# Altium schematic sheet General_design.SchDoc
size A3; Author: Sławomir Małkowski; Organization: Altium Limited; Address1: L3, 12a Rodborough Rd; Address2: Frenchs Forest; Address3: NSW; Address4: Australia 2086; DocumentNumber: 1; SheetNumber: 1; SheetTotal: 19
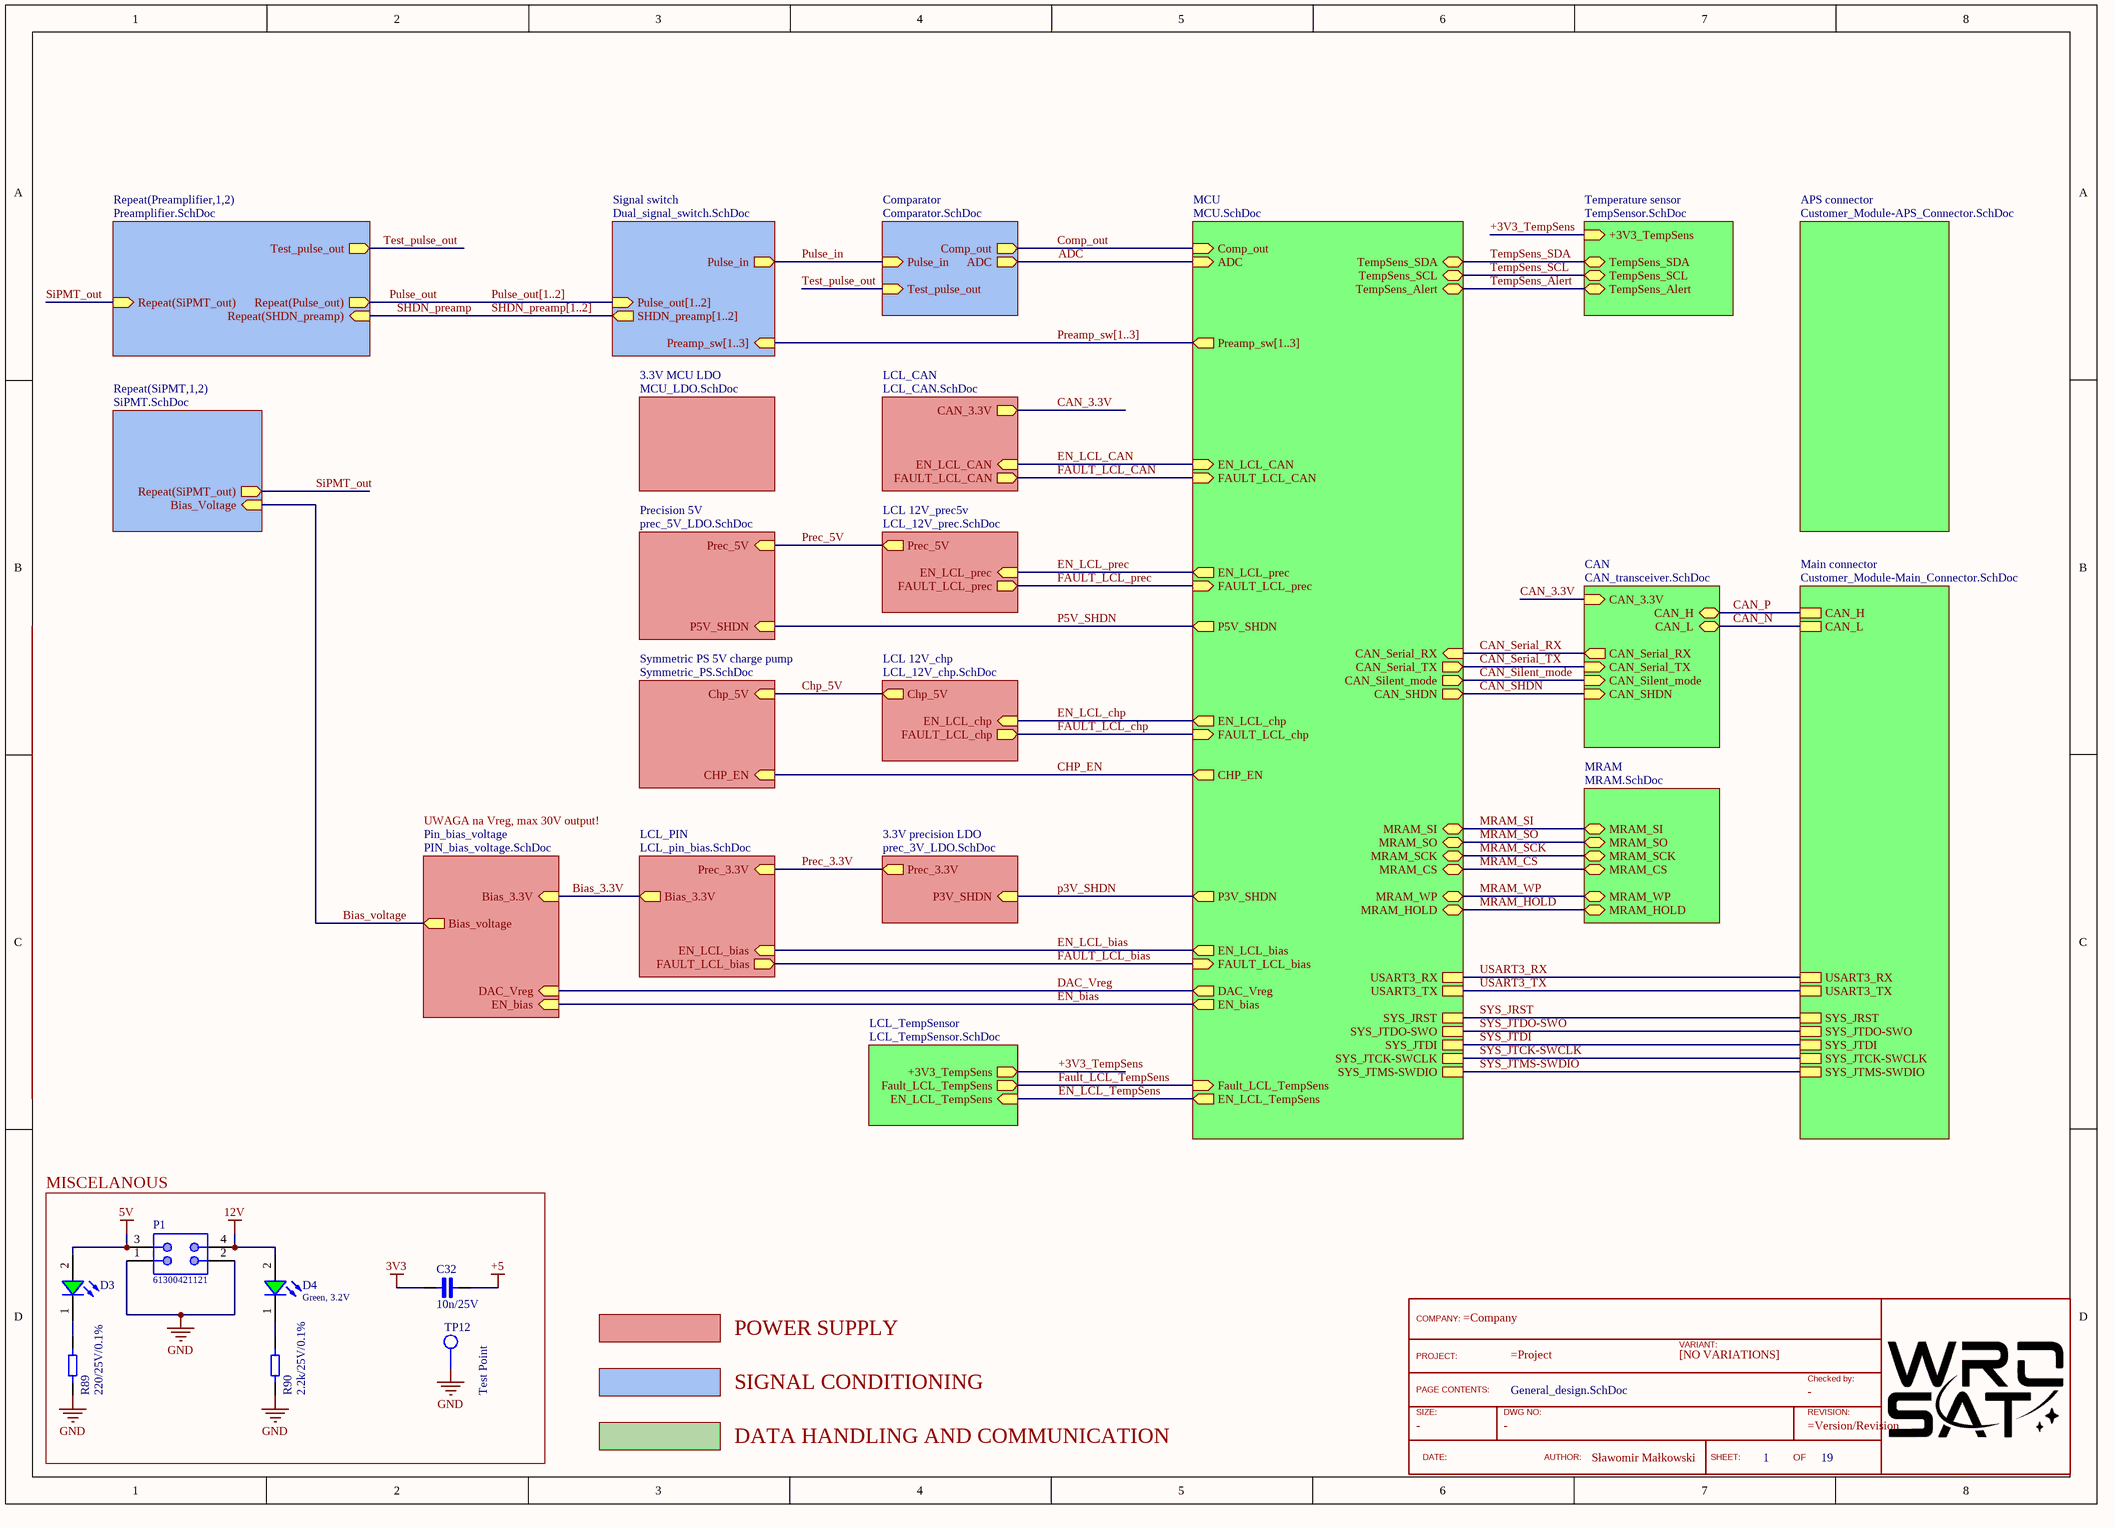
[diagram p0: General_design.SchDoc]

## Parts
?  TitleBlock  (value not drawn)  (graphical)
C32  10n/25V  [Cap_0402]
D3  Green, 3.2V  [WL-SMCW_0603_H=0.7mm]  (value not drawn)
D4  Green, 3.2V  [WL-SMCW_0603_H=0.7mm]
P1  61300421121  [61300421121]
R89  220/25V/0.1%  [RES_0402]
R90  2.2k/25V/0.1%  [RES_0402]
TP12  Test Point  [Test Point SMT]

## Blocks framed on the sheet
MISCELANOUS: C32 D3 D4 P1 R89 R90 TP12

## Sub-sheets
3.3V MCU LDO = MCU_LDO.SchDoc: no entries
3.3V precision LDO = prec_3V_LDO.SchDoc: Prec_3.3V (out), P3V_SHDN (in)
APS connector = Customer_Module-APS_Connector.SchDoc: no entries
CAN = CAN_transceiver.SchDoc: CAN_3.3V (in), CAN_Serial_RX (out), CAN_Serial_TX (in), CAN_H (bidir), CAN_L (bidir), CAN_Silent_mode (in), CAN_SHDN (in)
Comparator = Comparator.SchDoc: Pulse_in (in), Comp_out (out), Test_pulse_out (in), ADC (out)
LCL 12V_chp = LCL_12V_chp.SchDoc: Chp_5V (out), EN_LCL_chp (in), FAULT_LCL_chp (out)
LCL 12V_prec5v = LCL_12V_prec.SchDoc: Prec_5V (out), EN_LCL_prec (in), FAULT_LCL_prec (out)
LCL_CAN = LCL_CAN.SchDoc: EN_LCL_CAN (in), FAULT_LCL_CAN (out), CAN_3.3V (out)
LCL_PIN = LCL_pin_bias.SchDoc: EN_LCL_bias (in), FAULT_LCL_bias (out), Prec_3.3V (in), Bias_3.3V (out)
LCL_TempSensor = LCL_TempSensor.SchDoc: +3V3_TempSens (out), Fault_LCL_TempSens (out), EN_LCL_TempSens (in)
Main connector = Customer_Module-Main_Connector.SchDoc: SYS_JTCK-SWCLK, SYS_JTMS-SWDIO, CAN_H, USART3_RX, CAN_L, SYS_JRST, USART3_TX, SYS_JTDO-SWO, SYS_JTDI
MCU = MCU.SchDoc: Preamp_sw[1..3] (out), Comp_out (in), P3V_SHDN (out), P5V_SHDN (out), CHP_EN (out), EN_LCL_bias (out), FAULT_LCL_bias (in), EN_LCL_prec (out), FAULT_LCL_prec (in), EN_LCL_chp (out), FAULT_LCL_chp (in), EN_bias (out), CAN_Serial_RX (in), CAN_Serial_TX (out), CAN_Silent_mode (out), MRAM_SO (bidir), MRAM_SCK (bidir), MRAM_WP (bidir), MRAM_HOLD (bidir), MRAM_CS (bidir), MRAM_SI (bidir), DAC_Vreg (out), CAN_SHDN (out), SYS_JRST, SYS_JTDO-SWO, SYS_JTDI, SYS_JTCK-SWCLK, SYS_JTMS-SWDIO, USART3_RX, USART3_TX, EN_LCL_CAN (in), FAULT_LCL_CAN (in), TempSens_SDA (bidir), TempSens_SCL (bidir), TempSens_Alert (bidir), Fault_LCL_TempSens (in), EN_LCL_TempSens (out), ADC (in)
MRAM = MRAM.SchDoc: MRAM_SO (bidir), MRAM_SCK (bidir), MRAM_WP (bidir), MRAM_HOLD (bidir), MRAM_CS (bidir), MRAM_SI (bidir)
Pin_bias_voltage = PIN_bias_voltage.SchDoc: Bias_voltage (out), Bias_3.3V (in), EN_bias (in), DAC_Vreg (in)
Precision 5V = prec_5V_LDO.SchDoc: Prec_5V (in), P5V_SHDN (in)
Repeat(Preamplifier,1,2) = Preamplifier.SchDoc: Repeat(SiPMT_out) (in), Repeat(Pulse_out) (out), Repeat(SHDN_preamp) (in), Test_pulse_out (out)
Repeat(SiPMT,1,2) = SiPMT.SchDoc: Bias_Voltage (in), Repeat(SiPMT_out) (out)
Signal switch = Dual_signal_switch.SchDoc: Pulse_out[1..2] (in), Pulse_in (out), Preamp_sw[1..3] (in), SHDN_preamp[1..2] (out)
Symmetric PS 5V charge pump = Symmetric_PS.SchDoc: Chp_5V (in), CHP_EN (in)
Temperature sensor = TempSensor.SchDoc: TempSens_SDA (bidir), TempSens_SCL (bidir), TempSens_Alert (bidir), +3V3_TempSens (in)

## Nets
3V3: C32.1
5V: D3.2(A) P1.3
12V: D4.2(A) P1.4
+5: C32.2
GND: P1.1 P1.2 R89.1 R90.1 TP12.1
+3V3_TempSens: sheet Temperature sensor/+3V3_TempSens, sheet LCL_TempSensor/+3V3_TempSens
ADC: sheet MCU/ADC, sheet Comparator/ADC
Bias_3.3V: sheet Pin_bias_voltage/Bias_3.3V, sheet LCL_PIN/Bias_3.3V
Bias_voltage: sheet Repeat(SiPMT,1,2)/Bias_Voltage, sheet Pin_bias_voltage/Bias_voltage
CAN_3.3V: sheet CAN/CAN_3.3V, sheet LCL_CAN/CAN_3.3V
CAN_N: sheet CAN/CAN_L, sheet Main connector/CAN_L
CAN_P: sheet CAN/CAN_H, sheet Main connector/CAN_H
CAN_Serial_RX: sheet MCU/CAN_Serial_RX, sheet CAN/CAN_Serial_RX
CAN_Serial_TX: sheet MCU/CAN_Serial_TX, sheet CAN/CAN_Serial_TX
CAN_SHDN: sheet MCU/CAN_SHDN, sheet CAN/CAN_SHDN
CAN_Silent_mode: sheet MCU/CAN_Silent_mode, sheet CAN/CAN_Silent_mode
Chp_5V: sheet Symmetric PS 5V charge pump/Chp_5V, sheet LCL 12V_chp/Chp_5V
CHP_EN: sheet MCU/CHP_EN, sheet Symmetric PS 5V charge pump/CHP_EN
Comp_out: sheet MCU/Comp_out, sheet Comparator/Comp_out
DAC_Vreg: sheet Pin_bias_voltage/DAC_Vreg, sheet MCU/DAC_Vreg
EN_bias: sheet Pin_bias_voltage/EN_bias, sheet MCU/EN_bias
EN_LCL_bias: sheet MCU/EN_LCL_bias, sheet LCL_PIN/EN_LCL_bias
EN_LCL_CAN: sheet MCU/EN_LCL_CAN, sheet LCL_CAN/EN_LCL_CAN
EN_LCL_chp: sheet MCU/EN_LCL_chp, sheet LCL 12V_chp/EN_LCL_chp
EN_LCL_prec: sheet MCU/EN_LCL_prec, sheet LCL 12V_prec5v/EN_LCL_prec
EN_LCL_TempSens: sheet MCU/EN_LCL_TempSens, sheet LCL_TempSensor/EN_LCL_TempSens
FAULT_LCL_bias: sheet MCU/FAULT_LCL_bias, sheet LCL_PIN/FAULT_LCL_bias
FAULT_LCL_CAN: sheet MCU/FAULT_LCL_CAN, sheet LCL_CAN/FAULT_LCL_CAN
FAULT_LCL_chp: sheet MCU/FAULT_LCL_chp, sheet LCL 12V_chp/FAULT_LCL_chp
FAULT_LCL_prec: sheet MCU/FAULT_LCL_prec, sheet LCL 12V_prec5v/FAULT_LCL_prec
Fault_LCL_TempSens: sheet MCU/Fault_LCL_TempSens, sheet LCL_TempSensor/Fault_LCL_TempSens
MRAM_CS: sheet MCU/MRAM_CS, sheet MRAM/MRAM_CS
MRAM_HOLD: sheet MCU/MRAM_HOLD, sheet MRAM/MRAM_HOLD
MRAM_SCK: sheet MCU/MRAM_SCK, sheet MRAM/MRAM_SCK
MRAM_SI: sheet MCU/MRAM_SI, sheet MRAM/MRAM_SI
MRAM_SO: sheet MCU/MRAM_SO, sheet MRAM/MRAM_SO
MRAM_WP: sheet MCU/MRAM_WP, sheet MRAM/MRAM_WP
p3V_SHDN: sheet MCU/P3V_SHDN, sheet 3.3V precision LDO/P3V_SHDN
P5V_SHDN: sheet MCU/P5V_SHDN, sheet Precision 5V/P5V_SHDN
Prec_3.3V: sheet 3.3V precision LDO/Prec_3.3V, sheet LCL_PIN/Prec_3.3V
Prec_5V: sheet Precision 5V/Prec_5V, sheet LCL 12V_prec5v/Prec_5V
Pulse_in: sheet Comparator/Pulse_in, sheet Signal switch/Pulse_in
Pulse_out: sheet Repeat(Preamplifier,1,2)/Repeat(Pulse_out)  [also labelled Pulse_out[1..2]]
SHDN_preamp: sheet Repeat(Preamplifier,1,2)/Repeat(SHDN_preamp)  [also labelled SHDN_preamp[1..2]]
SiPMT_out: sheet Repeat(SiPMT,1,2)/Repeat(SiPMT_out), sheet Repeat(Preamplifier,1,2)/Repeat(SiPMT_out)
SYS_JRST: sheet MCU/SYS_JRST, sheet Main connector/SYS_JRST
SYS_JTCK-SWCLK: sheet MCU/SYS_JTCK-SWCLK, sheet Main connector/SYS_JTCK-SWCLK
SYS_JTDI: sheet MCU/SYS_JTDI, sheet Main connector/SYS_JTDI
SYS_JTDO-SWO: sheet MCU/SYS_JTDO-SWO, sheet Main connector/SYS_JTDO-SWO
SYS_JTMS-SWDIO: sheet MCU/SYS_JTMS-SWDIO, sheet Main connector/SYS_JTMS-SWDIO
TempSens_Alert: sheet MCU/TempSens_Alert, sheet Temperature sensor/TempSens_Alert
TempSens_SCL: sheet MCU/TempSens_SCL, sheet Temperature sensor/TempSens_SCL
TempSens_SDA: sheet MCU/TempSens_SDA, sheet Temperature sensor/TempSens_SDA
Test_pulse_out: sheet Repeat(Preamplifier,1,2)/Test_pulse_out, sheet Comparator/Test_pulse_out
USART3_RX: sheet MCU/USART3_RX, sheet Main connector/USART3_RX
USART3_TX: sheet MCU/USART3_TX, sheet Main connector/USART3_TX
NetD3_1: D3.1(K) R89.2
NetD4_1: D4.1(K) R90.2

## Buses and harness runs
bus Preamp_sw[1..3] = sheet MCU/Preamp_sw[1..3] = sheet Signal switch/Preamp_sw[1..3]

## Notes on the sheet
- UWAGA na Vreg, max 30V output!
- POWER SUPPLY
- SIGNAL CONDITIONING
- DATA HANDLING AND COMMUNICATION
- Title
- Size:
- Date:
- A3
- Number:
- Time:
- Revision:
- Sheet
- of
- File:
- (in symbol TitleBlock) COMPANY:; VARIANT:; PROJECT:; [NO VARIATIONS]; Checked by:; PAGE CONTENTS:; SIZE:; DWG NO:; REVISION:; DATE:; AUTHOR:; SHEET:; OF

## Library data of the parts
? = TitleBlock: Standard TitleBlock; DrawingNo: -; Size: -; Checked: -
C32 = Cap_0402_10n: Ceramic Capacitor 10n / 0402 / 25V / ±5%, Wurth Elektronik MLCC; ComponentLink1Description: New link; ComponentLink1URL: https://www.we-online.com/catalog/en/WCAP-CSGP-25VDC
D3 D4 = 150060GS75000: WL-SMCW SMT Mono-color Chip LED Waterclear, size 0603, Green, 3.2V, 140deg; Chip Technology: InGaN; Dominant Wavelength typ.: 525nm; Luminous Intensity typ.: 430mcd; Peak Wavelength typ.: 515nm; Viewing Angle: 140deg; ComponentLink1Description: Manufacturer; ComponentLink1URL: http://www.we-online.de; ComponentLink2URL: https://www.we-online.com/catalog/datasheet/150060GS75000.pdf; ComponentLink2Description: Datasheet; Forward Voltage typ.: 3.2V; Emitting Color: Green; Mounting Technology: SMT; Operating Temperature: -40 to +85degC; Published Date: December 2019; Part Number: 150060GS75000; Packaging: Tape and Reel; Size: 0603; Publisher: Wurth Elektronik
P1 = 61300421121: WR-PHD Pin Header, THT, pitch 2.54mm, Dual Row, Vertical, 4p; Manufacturer: Wurth Elektronik; Pin Number: 4; Rated Current: 3A; Working Voltage: 250VAC; Withstanding Voltage: 500VAC; Contact Resistance: 20mOhm; ComponentLink1Description: Manufacturer; ComponentLink1URL: http://www.we-online.de; ComponentLink2Description: Datasheet; ComponentLink2URL: https://www.we-online.com/catalog/datasheet/61300421121.pdf; Manufacturer Part Number: 61300421121; Published Date: May 2020; Pitch: 2.54mm; Operating Temperature: -40 to +105degC; Mounting Technology: THT; Packaging: Bag; Gender: Pin Header; Row Number: Dual; Orientation: Vertical
R89 = Res_0402_1: Vishay, thin film resistor 1/25V/0.1%
R90 = Res_0402_1: Vishay, thin film resistor 2.2k/25V/0.1%